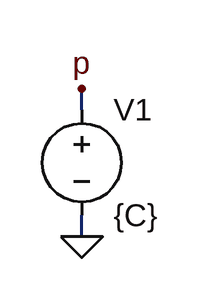
[diagram p0: schematic const.asc]
const.asc, the LTspice schematic file:
Version 4
SHEET 1 880 680
WIRE 176 112 176 96
WIRE 176 208 176 192
FLAG 176 208 0
FLAG 176 96 p
SYMBOL voltage 176 96 R0
SYMATTR InstName V1
SYMATTR Value {C}

The netlist it stands for:
* const.asc
V1 p 0 {C}
.backanno
.end